# Altium schematic sheet Power.SchDoc
size A3
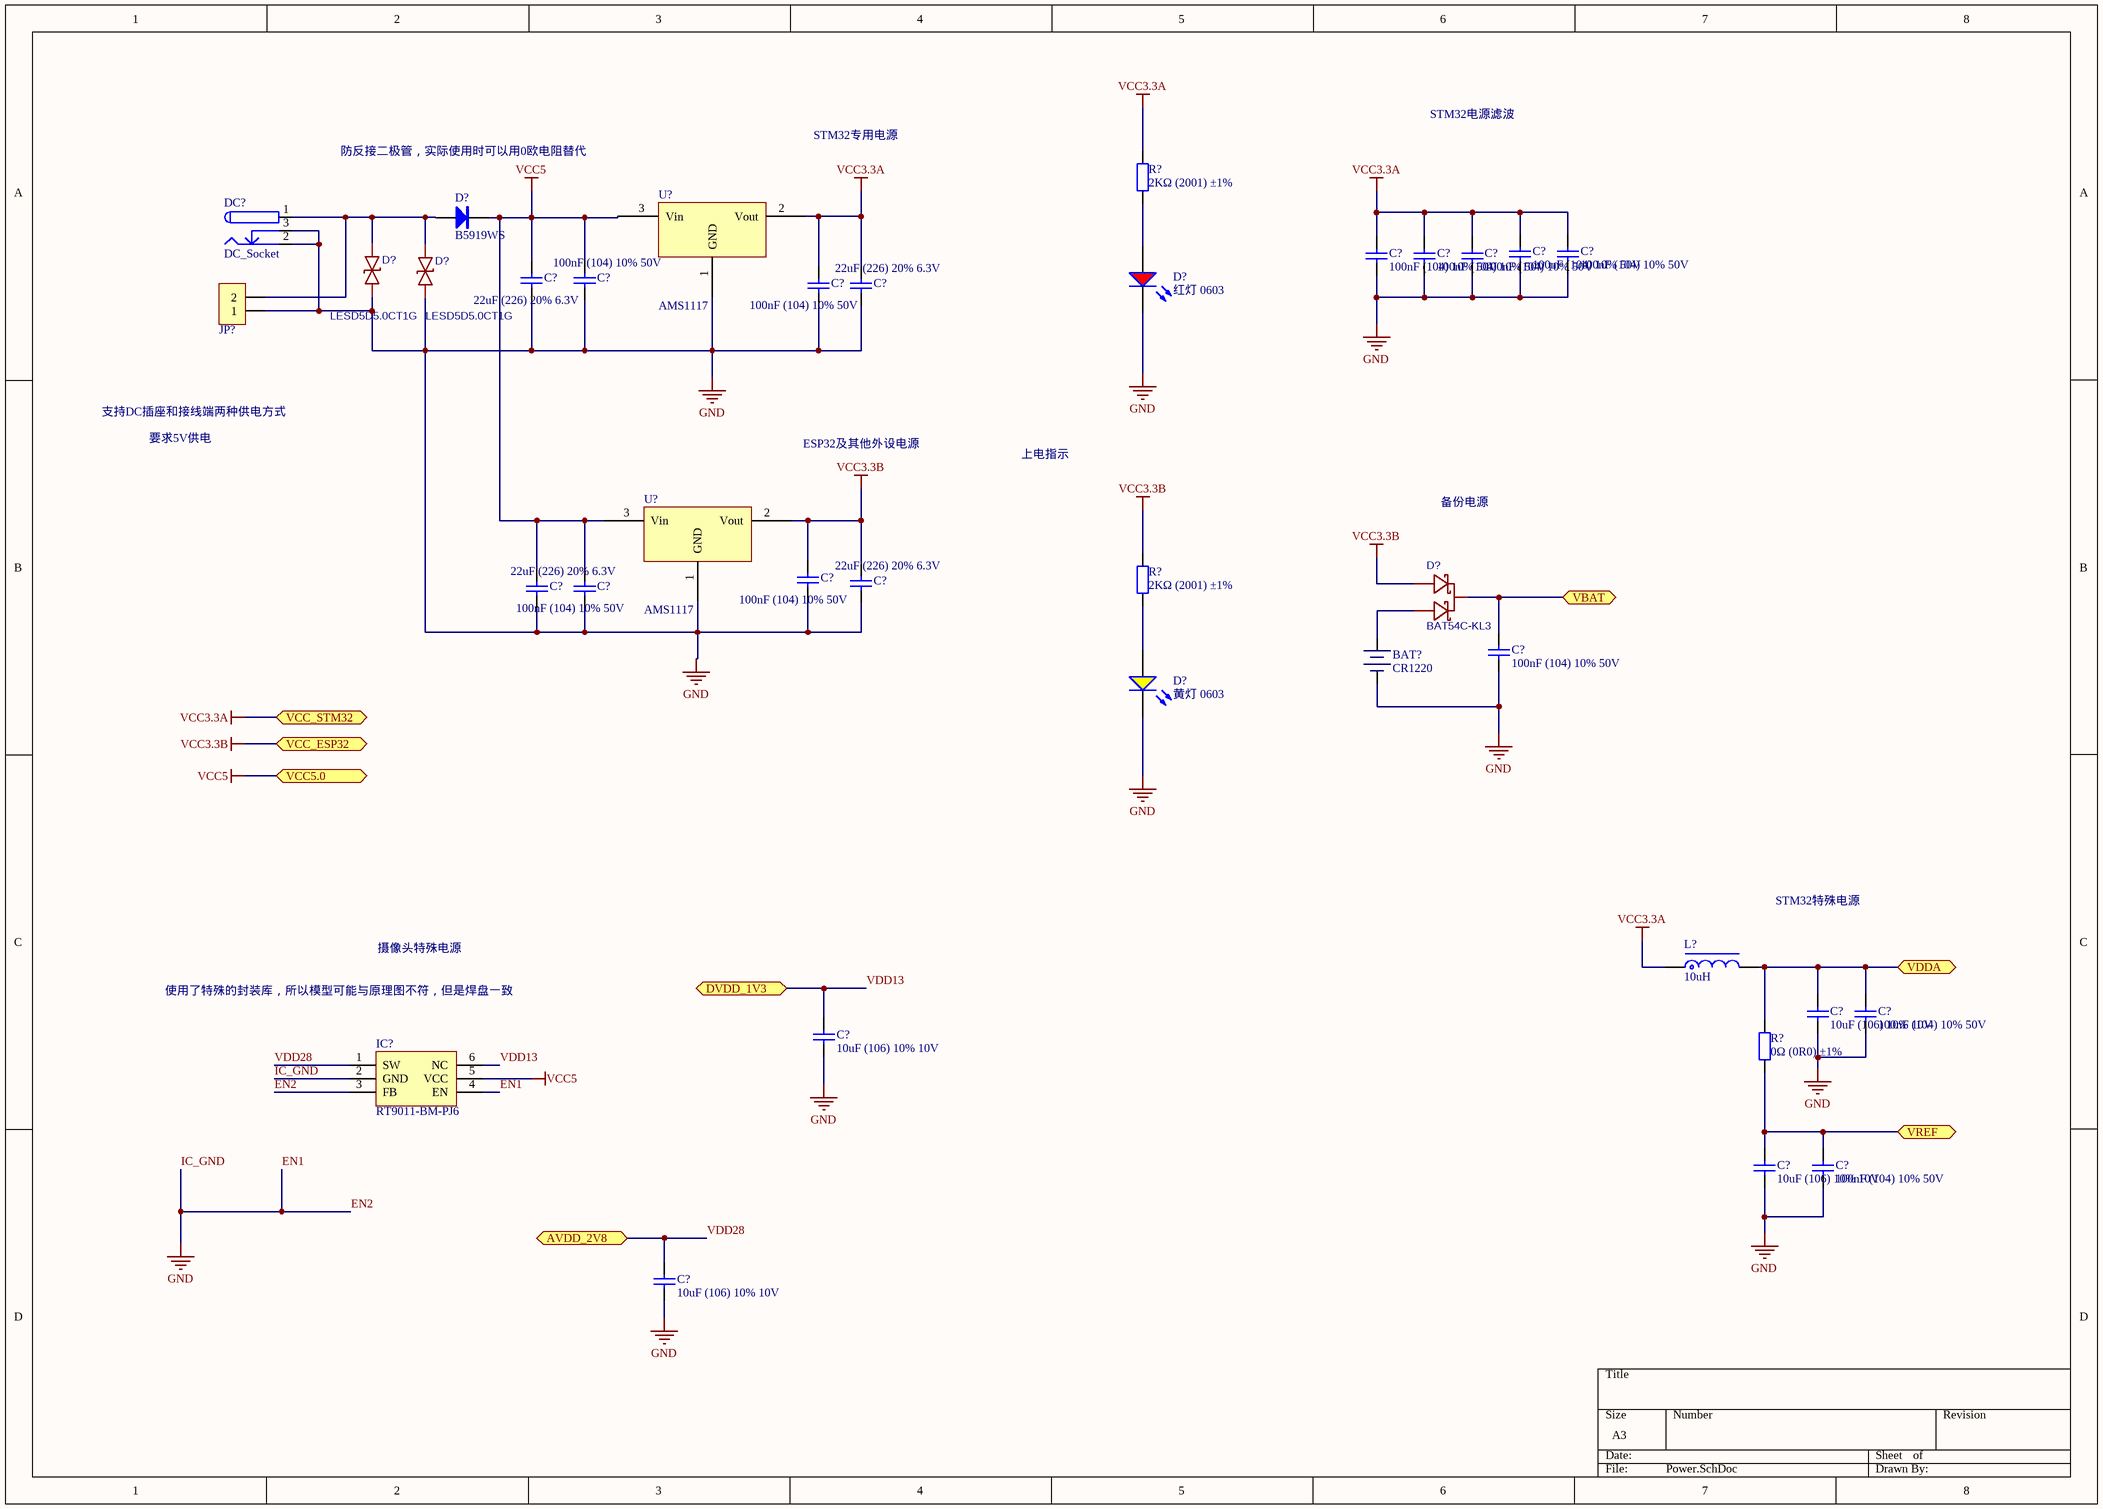
[diagram p0: Power.SchDoc]

## Parts
(Parts that share a designator on the sheet are numbered #1, #2 ... from top to bottom, then left to right.)
BAT?  CR1220  [CR1220-A]
C?#1  100nF (104) 10% 50V  [0603_C]
C?#2  100nF (104) 10% 50V  [0603_C]
C?#3  100nF (104) 10% 50V  [0603_C]
C?#4  100nF (104) 10% 50V  [0603_C]
C?#5  100nF (104) 10% 50V  [0603_C]
C?#6  22uF (226) 20% 6.3V  [0603_C]
C?#7  100nF (104) 10% 50V  [0603_C]
C?#8  100nF (104) 10% 50V  [0603_C]
C?#9  22uF (226) 20% 6.3V  [0603_C]
C?#10  100nF (104) 10% 50V  [0603_C]
C?#11  22uF (226) 20% 6.3V  [0603_C]
C?#12  100nF (104) 10% 50V  [0603_C]
C?#13  22uF (226) 20% 6.3V  [0603_C]
C?#14  100nF (104) 10% 50V  [0603_C]
C?#15  10uF (106) 10% 10V  [0603_C]
C?#16  10uF (106) 10% 10V  [0603_C]
C?#17  100nF (104) 10% 50V  [0603_C]
C?#18  10uF (106) 10% 10V  [0603_C]
C?#19  100nF (104) 10% 50V  [0603_C]
C?#20  10uF (106) 10% 10V  [0603_C]
D?#1  红灯 0603  [0603_LED_S1]
D?#2  B5919WS  [SOD-323]
D?#3  LESD5D5.0CT1G  [LESD5D5.0CT1G]
D?#4  LESD5D5.0CT1G  [LESD5D5.0CT1G]
D?#5  BAT54C-KL3  [BAT54C_KL3]
D?#6  黄灯 0603  [0603_LED_S1]
DC?  DC_Socket  [DC-005]
IC?  RT9011-BM-PJ6  [SOT23-6N]
JP?  HDR-1X2  [KF350-2P]  (value not drawn)
L?  10uH  [CD31]
R?#1  2KΩ (2001) ±1%  [0603_R]
R?#2  2KΩ (2001) ±1%  [0603_R]
R?#3  0Ω (0R0) ±1%  [0603_R]
U?#1  AMS1117  [SOT223]
U?#2  AMS1117  [SOT223]

## Ports
AVDD_2V8 (bidir), DVDD_1V3 (bidir), VBAT (bidir), VCC5.0 (bidir), VCC_ESP32 (bidir), VCC_STM32 (bidir), VDDA (bidir), VREF (bidir)

## Nets
EN1: BAT?.2 C?#1.1 C?#2.1 C?#3.1 C?#4.1 C?#5.1 C?#6.1 C?#7.1 C?#8.1 C?#9.1 C?#10.1 C?#11.1 C?#12.1 C?#13.1 C?#14.1 C?#15.2 C?#16.1 C?#17.1 C?#18.1 C?#19.1 C?#20.2 D?#1.K D?#3.1 D?#4.1 D?#6.K DC?.2 DC?.3 IC?.2(GND) IC?.3(FB) IC?.4(EN) JP?.1 U?#1.1(GND) U?#2.1(GND)  [also labelled EN2, GND, IC_GND]
VCC3.3A: C?#1.2 C?#2.2 C?#3.2 C?#4.2 C?#5.2 C?#8.2 C?#9.2 L?.1 R?#1.2 U?#1.2(Vout) ; port VCC_STM32
VCC3.3B: C?#10.2 C?#13.2 D?#5.1(A) R?#2.2 U?#2.2(Vout) ; port VCC_ESP32
VCC5: C?#6.2 C?#7.2 C?#11.2 C?#12.2 D?#2.2(K) IC?.5(VCC) U?#1.3(Vin) U?#2.3(Vin) ; port VCC5.0
VBAT: C?#14.2 D?#5.3(K) ; port VBAT
VDD13: C?#15.1 IC?.6(NC) ; port DVDD_1V3
VDD28: C?#20.1 IC?.1(SW) ; port AVDD_2V8
VDDA: C?#16.2 C?#17.2 L?.2 R?#3.2 ; port VDDA
VREF: C?#18.2 C?#19.2 R?#3.1 ; port VREF
NetBAT?_1: BAT?.1 D?#5.2(A)
NetD?#1_A: D?#1.A R?#1.1
NetD?#2_1: D?#2.1(A) D?#3.2 D?#4.2 DC?.1 JP?.2
NetD?#6_A: D?#6.A R?#2.1

## Notes on the sheet
- 防反接二极管，实际使用时可以用0欧电阻替代
- STM32专用电源
- STM32电源滤波
- 支持DC插座和接线端两种供电方式
- 要求5V供电
- ESP32及其他外设电源
- 上电指示
- 备份电源
- STM32特殊电源
- 摄像头特殊电源
- 使用了特殊的封装库，所以模型可能与原理图不符，但是焊盘一致

## Library data of the parts
C?#1-C?#5 C?#7 C?#8 C?#10 C?#12 C?#14 C?#17 C?#19 = 0603 100nF (104) 10% 50V: 贴片电容; ComponentLink1Description: 供应商链接; ComponentLink1URL: http://www.szlcsc.com/product/details_15331.html; Package: 0603; Supplier: LC; SuppliersPartNumber: C14663
C?#6 C?#9 C?#11 C?#13 = 0603 22uF (226) 20% 6.3V: 贴片电容; ComponentLink1Description: 供应商链接; ComponentLink1URL: http://www.szlcsc.com/product/details_60514.html; Package: 0603; Supplier: LC; SuppliersPartNumber: C59461
C?#15 C?#16 C?#18 C?#20 = 0603 10uF (106) 10% 10V: 贴片电容; ComponentLink1Description: 供应商链接; ComponentLink1URL: http://www.szlcsc.com/product/details_20411.html; Package: 0603; Supplier: LC; SuppliersPartNumber: C19702
D?#1 = 0603 红灯: 发光二极管; ComponentLink1Description: 供应商链接; ComponentLink1URL: http://www.szlcsc.com/product/details_2659.html; Package: 0603; Supplier: LC; SuppliersPartNumber: C2286
D?#2 = 1N5819: 肖特基二极管; 版权归属: 源创客; 属性: 40V/2A; BOM名称: 肖特基二极管; 学习资源: www.ooocke.com
D?#3 D?#4 = LESD5D5.0CT1G: BOM_Manufacturer: Leshan Radio; Contributor: LCSC; BOM_Paste Type: expand; BOM_Supplier: LCSC; BOM_Supplier Part: C383211; BOM_Manufacturer Part: LESD5D5.0CT1G; spicePre: D; spiceSymbolName: LESD5D5.0CT1G
D?#5 = BAT54C-KL3: BOM_Manufacturer: ZRE; Contributor: LCSC; BOM_Supplier: LCSC; BOM_Supplier Part: C779698; BOM_Manufacturer Part: BAT54C-KL3; spicePre: D; spiceSymbolName: BAT54C-KL3
D?#6 = 0603 黄灯: 发光二极管; ComponentLink1Description: 供应商链接; ComponentLink1URL: http://www.szlcsc.com/product/details_73147.html; Package: 0603; Supplier: LC; SuppliersPartNumber: C72038
IC? = SX1308: 可调升压芯片; 版权归属: 源创客; BOM名称: 可调升压芯片; 学习资源: www.ooocke.com
JP? = Header 2: 2P接插件; 版权归属: 源创客; BOM名称: 2P接插件; 学习资源: www.ooocke.com
L? = L-CD: 贴片功率电感; BOM名称: 功率电感; 版权归属: 源创客; 学习资源: www.ooocke.com
R?#1 R?#2 = 0603 2KΩ (2001) 1%: 贴片电阻; ComponentLink1Description: 供应商链接; ComponentLink1URL: http://www.szlcsc.com/product/details_23702.html; Package: 0603; Supplier: LC; SuppliersPartNumber: C22975
R?#3 = 0603 0Ω (0R0) 1%: 贴片电阻; ComponentLink1Description: 供应商链接; ComponentLink1URL: http://www.szlcsc.com/product/details_21903.html; Package: 0603; Supplier: LC; SuppliersPartNumber: C21189
U?#1 U?#2 = AMS1117: 三端稳压芯片